# Altium schematic sheet Cap_EEPROM.SchDoc
size 297 x 209 mm
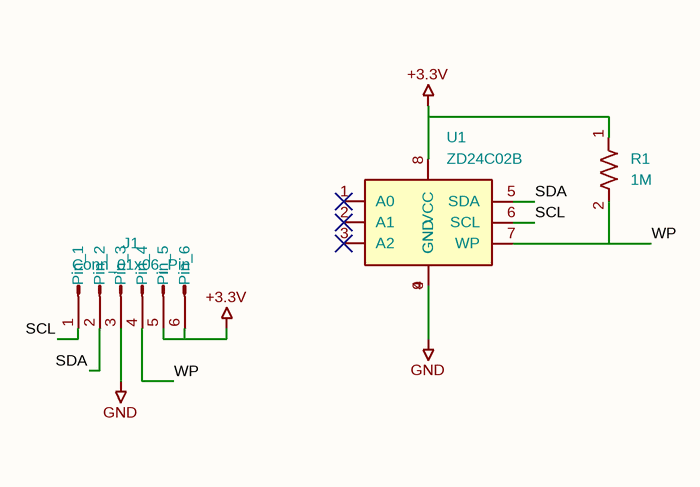
[diagram p0: Cap_EEPROM.SchDoc]

## Parts
J1  Conn_01x06_Pin  [EEPROM_Board_Pads]
R1  1M  [R_0402_1005Metric_Pad0.72x0.64mm_HandSolder]
U1  ZD24C02B  [DFN-8-1EP_3x2mm_P0.5mm_EP1.3x1.5mm]

## Nets
+3.3V: J1.5(Pin_5) J1.6(Pin_6) R1.1 U1.8(VCC)
GND: J1.3(Pin_3) U1.4(GND) U1.9(GND)
SCL: J1.1(Pin_1) U1.6(SCL)
SDA: J1.2(Pin_2) U1.5(SDA)
WP: J1.4(Pin_4) R1.2 U1.7(WP)

Not connected (* = marked no-connect by the designer): U1 1(A0)* 2(A1)* 3(A2)*

## Notes on the sheet
- 1
- 2
- 3
- 4
- 5
- 6
- A
- B
- C
- D
- Title:
- File: Cap_EEPROM.kicad_sch
- Sheet: /
- KiCad E.D.A.  kicad (5.1.4)-1
- Size: A4
- Date:
- Rev:
- Id: 1/1

## Library data of the parts
J1 = Conn_01x06_Pin: Description: Generic connector, single row, 01x06, script generated; Value: Conn_01x06_Pin; Footprint: Custom:EEPROM_Board_Pads
R1 = R_US: Description: Resistor, US symbol; Value: 1M; Footprint: Resistor_SMD:R_0402_1005Metric_Pad0.72x0.64mm_HandSolder
U1 = AT24CS01-MAHM: Description: I2C Serial EEPROM, 2Kb (256x8), UDFN8; Value: ZD24C02B; Footprint: Package_DFN_QFN:DFN-8-1EP_3x2mm_P0.5mm_EP1.3x1.5mm